# Altium schematic sheet p07_cpu_renesas_144.SchDoc
size A3
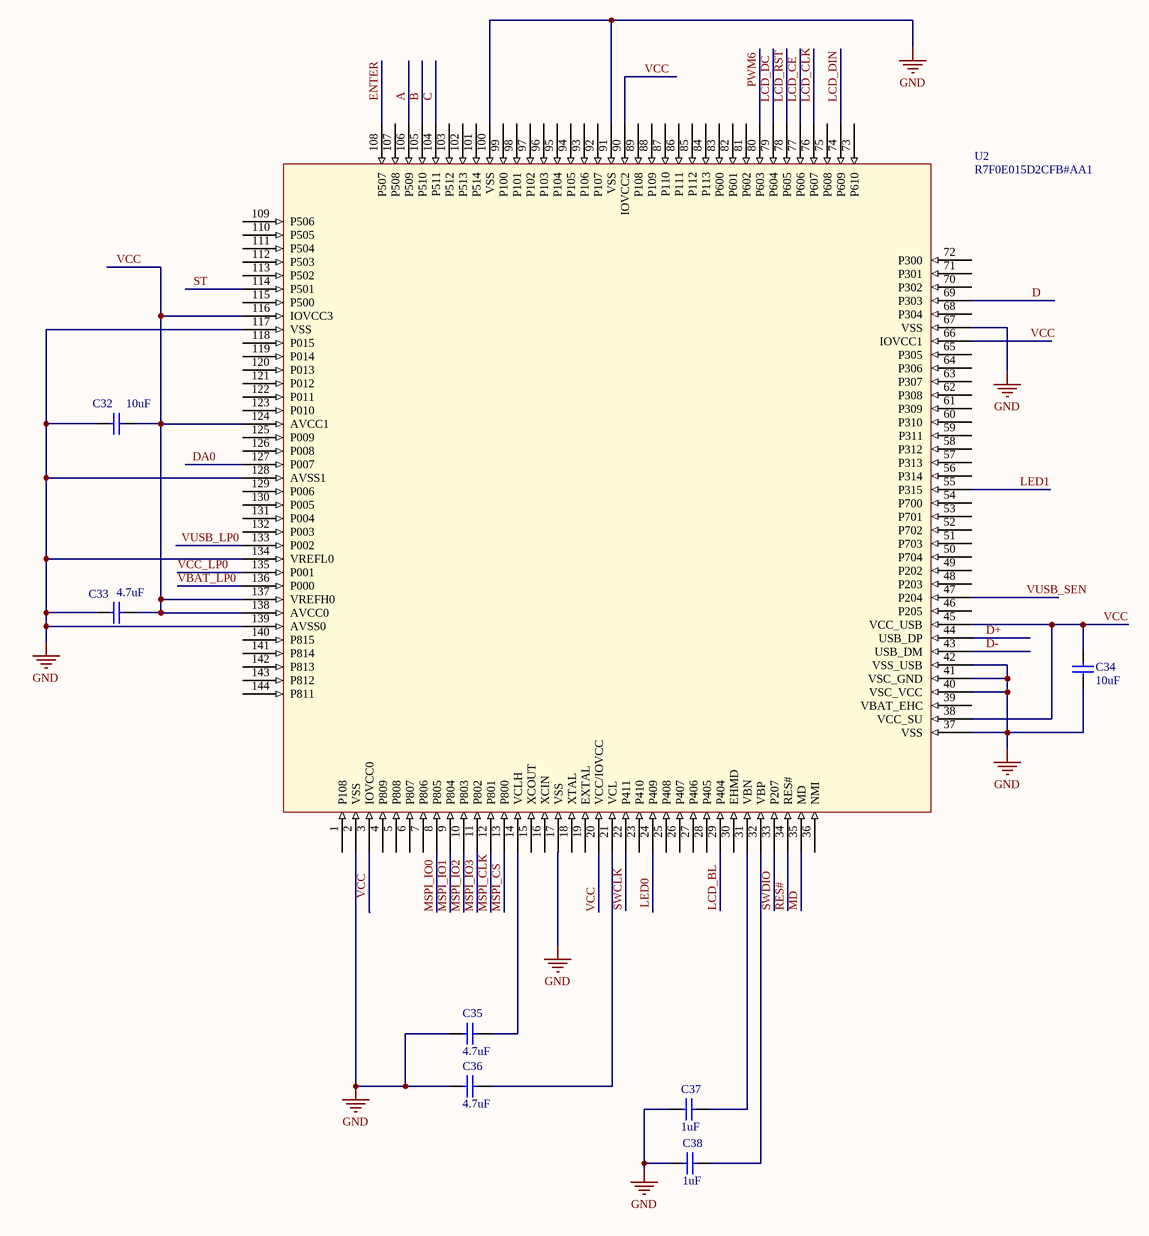
[diagram p0: p07_cpu_renesas_144.SchDoc]

## Parts
C32  value 10uF  [C1206]  (hidden comment: Cap)
C33  value 4.7uF  [C1206]  (hidden comment: Cap)
C34  value 10uF  [C1206]  (hidden comment: Cap)
C35  value 4.7uF  [C1206]  (hidden comment: Cap)
C36  value 4.7uF  [C1206]  (hidden comment: Cap)
C37  value 1uF  [C0805]  (hidden comment: Cap)
C38  value 1uF  [C0805]  (hidden comment: Cap)
U2  R7F0E015D2CFB#AA1  [SQFP50P2200X2200X170-144N]

## Nets
GND: C32.2 C33.2 C34.1 C35.2 C36.2 C37.1 C38.1 U2.2(VSS) U2.17(VSS) U2.37(VSS) U2.40(VSC_VCC) U2.41(VSC_GND) U2.42(VSS_USB) U2.67(VSS) U2.91(VSS) U2.100(VSS) U2.117(VSS) U2.128(AVSS1) U2.134(VREFL0) U2.139(AVSS0)
A: U2.106(P509)
B: U2.105(P510)
C: U2.104(P511)
D: U2.69(P303)
D+: U2.44(USB_DP)
D-: U2.43(USB_DM)
DA0: U2.127(P007)
ENTER: U2.108(P507)
LCD_BL: U2.29(P404)
LCD_CE: U2.77(P606)
LCD_CLK: U2.76(P607)
LCD_DC: U2.79(P604)
LCD_DIN: U2.74(P609)
LCD_RST: U2.78(P605)
LED0: U2.24(P409)
LED1: U2.55(P315)
MD: U2.35(MD)
MSPI_CLK: U2.12(P801)
MSPI_CS: U2.13(P800)
MSPI_IO0: U2.8(P805)
MSPI_IO1: U2.9(P804)
MSPI_IO2: U2.10(P803)
MSPI_IO3: U2.11(P802)
PWM6: U2.80(P603)
RES#: U2.34(RES#)
ST: U2.114(P501)
SWCLK: U2.22(P411)
SWDIO: U2.33(P207)
VBAT_LP0: U2.136(P000)
VCC: C32.1 C33.1 C34.2 U2.3(IOVCC0) U2.20(VCC/IOVCC) U2.38(VCC_SU) U2.45(VCC_USB) U2.66(IOVCC1) U2.90(IOVCC2) U2.116(IOVCC3) U2.124(AVCC1) U2.137(VREFH0) U2.138(AVCC0)
VCC_LP0: U2.135(P001)
VUSB_LP0: U2.133(P002)
VUSB_SEN: U2.47(P204)
NetC35_1: C35.1 U2.14(VCLH)
NetC36_1: C36.1 U2.21(VCL)
NetC37_2: C37.2 U2.31(VBN)
NetC38_2: C38.2 U2.32(VBP)

Not connected (* = marked no-connect by the designer): U2 1(P108) 4(P809) 5(P808) 6(P807) 7(P806) 15(XCOUT) 16(XCIN) 18(XTAL) 19(EXTAL) 23(P410) 25(P408) 26(P407) 27(P406) 28(P405) 30(EHMD) 36(NMI) 39(VBAT_EHC) 46(P205) 48(P203) 49(P202) 50(P704) 51(P703) 52(P702) 53(P701) 54(P700) 56(P314) 57(P313) 58(P312) 59(P311) 60(P310) 61(P309) 62(P308) 63(P307) 64(P306) 65(P305) 68(P304) 70(P302) 71(P301) 72(P300) 73(P610) 75(P608) 81(P602) 82(P601) 83(P600) 84(P113) 85(P112) 86(P111) 87(P110) 88(P109) 89(P108) 92(P107) 93(P106) 94(P105) 95(P104) 96(P103) 97(P102) 98(P101) 99(P100) 101(P514) 102(P513) 103(P512) 107(P508) 109(P506) 110(P505) 111(P504) 112(P503) 113(P502) 115(P500) 118(P015) 119(P014) 120(P013) 121(P012) 122(P011) 123(P010) 125(P009) 126(P008) 129(P006) 130(P005) 131(P004) 132(P003) 140(P815) 141(P814) 142(P813) 143(P812) 144(P811)

## Library data of the parts
C32-C38 = Cap: Capacitor; Published: 8-Jun-2000; LatestRevisionDate: 17-Jul-2002; LatestRevisionNote: Re-released for DXP Platform.; PackageReference: RAD-0.3; Publisher: Altium Limited; PackageDescription: Radial Cap, Thru-Hole; 2 Leads; 0.3 in Pin Spacing
U2 = R7F0E015D2CFB#AA1: ARM® Cortex®-M0+ series Microcontroller IC 32-Bit 24MHz 1.5MB (1.5M x 8) FLASH 144-LFQFP (20x20)